# EasyEDA Pro project ProPrj_三轮车_2025-08-24.epro, schematic Schematic4
Board Name: 电源板; Create Date: 2025-01-04; Page Name: P1; Project Name: 三轮车; Schematic Name: Schematic4; Update Date: 2025-01-04; Company: 嘉立创EDA; Page Size: A4; Version: V1.0
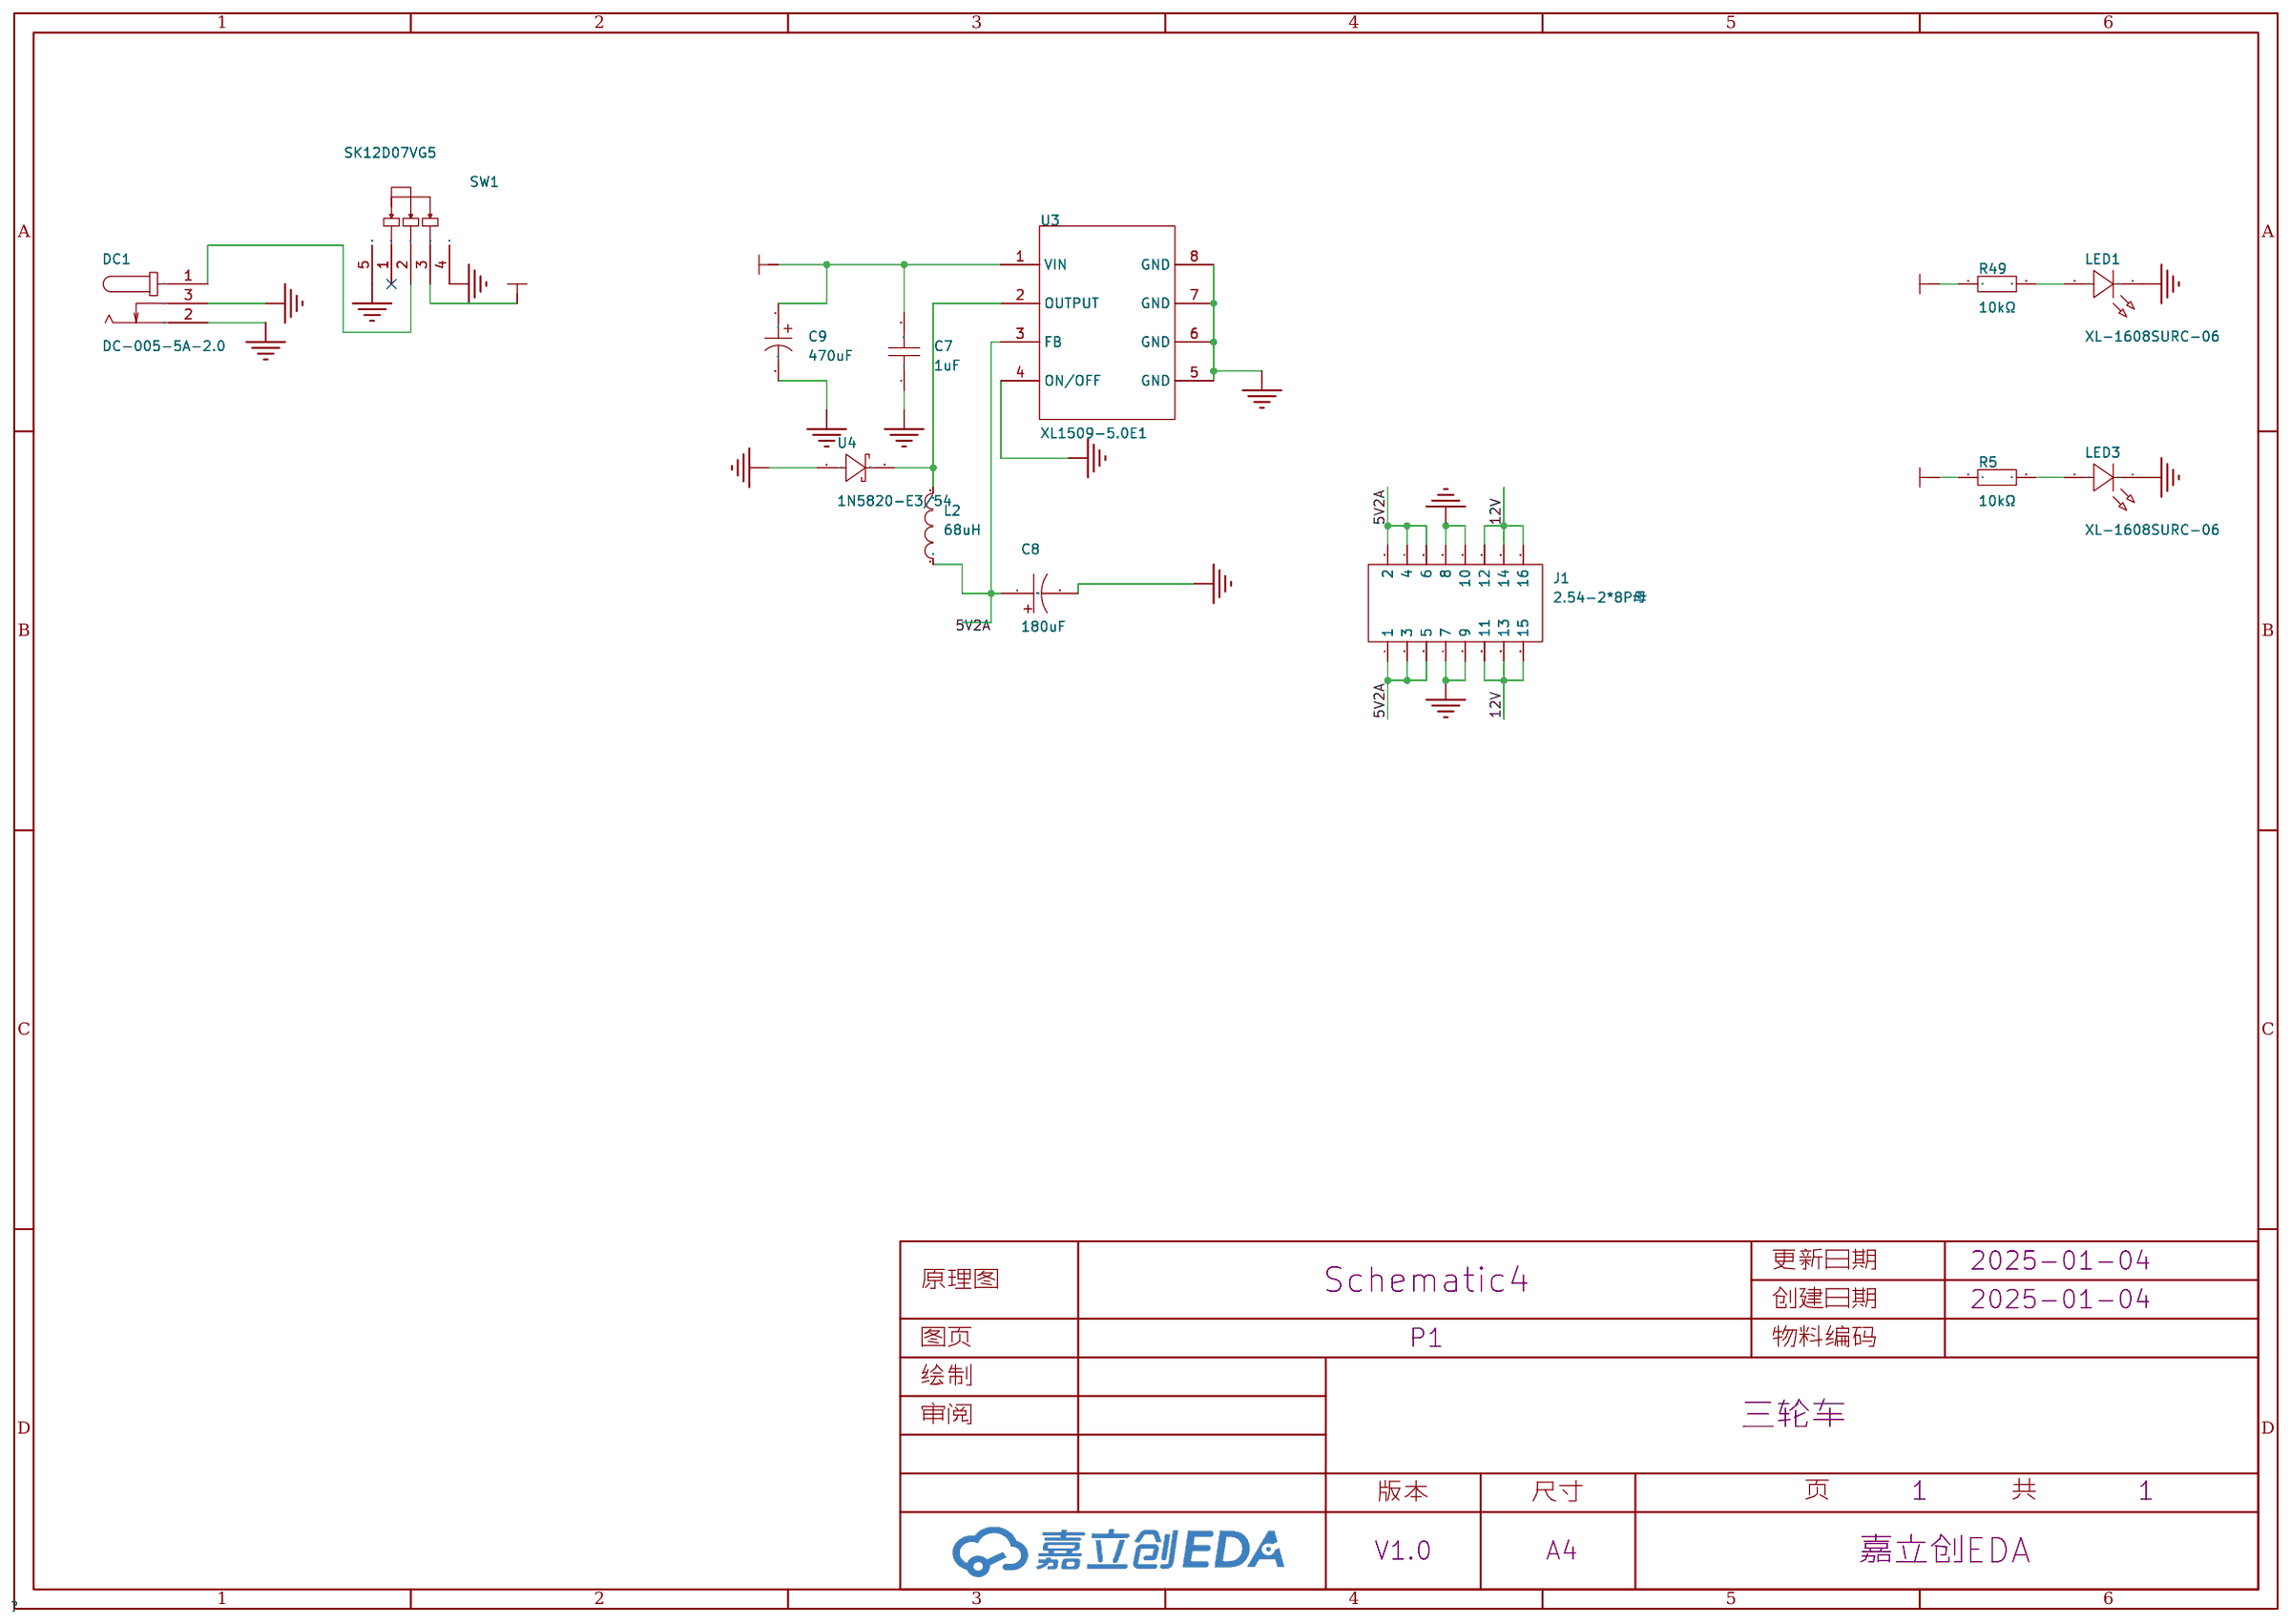
[diagram p5: schematic sheet]

## Parts
C7  1uF  [C0603]
C8  180uF  [CAP-TH_BD8.0-P3.50-D0.6-FD]
C9  470uF  [CAP-TH_BD8.0-P3.50-D0.6-FD_1]
DC1  DC-005-5A-2.0  [DC-IN-TH_DC-005-5A-2.0]
J1  2.54-2*8P母  [HDR-TH_16P-P2.54-V-F-R2-C8-S2.54]
L2  68uH  [IND-SMD_L7.1-W6.6-1]
LED1  XL-1608SURC-06  [LED0603-RD_RED]
LED3  XL-1608SURC-06  [LED0603-RD_RED]
R5  10kΩ  [R0603]
R49  10kΩ  [R0603]
SW1  SK12D07VG5  [SW-TH_SK12D07VG5]
U3  XL1509-5.0E1  [SOIC-8_L5.0-W4.0-P1.27-LS6.0-BL]
U4  1N5820-E3/54  [DO-201AD_BD5.3-L8.4-P12.50-D1.4-FD]

## Library data of the parts
C7 = CGA0603X5R105K160JT: 容值:1uF;精度:±10%;额定电压:16V;材质(温度系数):X5R;; LCSC Part Name: 1uF ±10% 16V; Supplier Part: C6119849; Manufacturer: HRE(芯声); Supplier Footprint: 0603; JLCPCB Part Class: 扩展库; Supplier: LCSC; Tolerance: ±10%; Voltage Rated: 16V; Temperature Coefficient: X5R
C8 = LKMD0901V181MF: 容值:180uF;精度:±20%;额定电压:35V;纹波电流:900mA@100kHz;等效串联电阻:210mΩ@100kHz;; LCSC Part Name: 180uF ±20% 35V; Supplier Part: C442870; Manufacturer: Ymin(永铭); Supplier Footprint: 插件,D8xL9mm; JLCPCB Part Class: 扩展库; Datasheet: https://atta.szlcsc.com/upload/public/pdf/source/20200220/C487520_443A40905984A455D375EE990FEAA9E8.pdf; Supplier: LCSC; Tolerance: ±20%; Rated Voltage: 35V; Ripple Current: 900mA@100kHz; Equivalent Series Resistance(ESR): 210mΩ@100kHz; Lead Spacing: 3.5mm; φD: 8mm; L: 9mm; Lifetime @ Temp: 10000hrs@105℃
C9 = CD2884771EM0812VFL: 容值:470uF;额定电压:25V;; LCSC Part Name: 470uF 25V; Supplier Part: C2960233; Manufacturer: HRK(鸿瑞凯电子); Supplier Footprint: 插件,D8xL12mm; JLCPCB Part Class: 扩展库; Datasheet: https://atta.szlcsc.com/upload/public/pdf/source/20240703/D49961C1CEC6E325964F7113D69E9087.pdf; Supplier: LCSC; Rated Voltage: 25V; φD: 8mm; L: 12mm; Operating Temperature: -40℃~+105℃
DC1 = DC-005-5A-2.0: 连接器类型:DC电源插座;安装方式:弯插;触点内径:2mm;触点外径:6.2mm;额定电流:5A;额定电压:24V;工作温度范围:-20℃~+70℃;; LCSC Part Name: DC电源插座 内径:2mm 外径:6.2mm; Supplier Part: C381116; Manufacturer: XKB Connection(中国星坤); Supplier Footprint: 插件; JLCPCB Part Class: 扩展库; Datasheet: https://atta.szlcsc.com/upload/public/pdf/source/20211015/707A35F7AB6E89C57AAB641950105BB7.pdf; Supplier: LCSC; Connector Type: DC电源插座; Mounting Style: 弯插; Inside Contact Diameter: 2mm; Outside Contact Diameter: 6.2mm; Current Rating (Max): 5A; Voltage Rating (Max): 24V; Operating Temperature Range: -20℃~+70℃
J1 = 2.54-2*8P母: 插孔结构:2x8P;间距:2.54mm;行距:2.54mm;安装类型:直插;排数:双排;总孔位数:16P;塑高:-;触头材质:黄铜;触头镀层:-;; LCSC Part Name: 间距:2.54mm 2x8P 直插; Supplier Part: C30734; Manufacturer: BOOMELE(博穆精密); Supplier Footprint: 插件,P=2.54mm; JLCPCB Part Class: 扩展库; Datasheet: https://atta.szlcsc.com/upload/public/pdf/source/20230817/400B44B2F3F98035DBB6B63900A9163B.pdf; Supplier: LCSC; Holes Structure: 2x8P; Pitch: 2.54mm; Row Spacing: 2.54mm; Mounting Type: 直插; Number of Rows: 双排; Number of Holes: 16P; Contact Material: 黄铜
L2 = PSPMAA0605H-680M-IGF: 电感值:68uH;精度:±20%;额定电流:2A;饱和电流(Isat):2.5A;; LCSC Part Name: 68uH ±20% 2.5A; Supplier Part: C2983094; Manufacturer: PROD(谱罗德); Supplier Footprint: SMD,6.6x7.1mm; JLCPCB Part Class: 扩展库; Datasheet: https://atta.szlcsc.com/upload/public/pdf/source/20220421/FA7B36985F5EDDBED7850D2E38F6BF27.pdf; Supplier: LCSC; Tolerance: ±20%; Rated Current: 2A; Saturation Current (Isat): 2.5A; DC Resistance (DCR): 256mΩ; Ratings: AEC-Q200
LED1 LED3 = XL-1608SURC-06: 发光颜色:红色;功率:55mW;正向电流:25mA;主波长:617nm~621nm;透镜颜色:无色透明透镜;色温:-;发光角度:120°;载带方式:正贴;工作温度:-30℃~+85℃;; Supplier Part: C965799; Manufacturer: XINGLIGHT(成兴光); Supplier Footprint: 0603; JLCPCB Part Class: 扩展库; Datasheet: https://atta.szlcsc.com/upload/public/pdf/source/20221102/D860AFDD1CDB02C5A8064103A32707E2.pdf; Supplier: LCSC; Emitted Color: 红色; Power Dissipation: 55mW; Forward Current: 25mA; Dominant Wavelength: 617nm~621nm; Peak Wavelength: 623nm; Lens Color: 无色透明透镜; Viewing Angle: 120°; Mounting Sytle: 正贴; Operating Temperature: -30℃~+85℃
R5 R49 = 0603WAF1002T5E: 电阻类型:厚膜电阻;阻值:10kΩ;精度:±1%;功率:100mW;最大工作电压:75V;温度系数:±100ppm/℃;; LCSC Part Name: 厚膜电阻 10kΩ ±1% 100mW; Supplier Part: C25804; Manufacturer: UNI-ROYAL(厚声); Supplier Footprint: 0603; JLCPCB Part Class: Basic Part; Datasheet: https://atta.szlcsc.com/upload/public/pdf/source/20200306/C422600_1E6D84923E4A46A82E41ADD87F860B5C.pdf; Supplier: LCSC; Type: 厚膜电阻; Tolerance: ±1%; Power(Watts): 100mW; Overload Voltage (Max): 75V; Temperature Coefficient: ±100ppm/℃; Operating Temperature Range: -55℃~+155℃
SW1 = SK12D07VG5: 电路结构:单刀双掷;安装方式:侧插;开关颜色:-;额定电流(DC):500mA;额定电压(DC):50V;额定电流(AC):-;额定电压(AC):-;机械寿命:5千次;; LCSC Part Name: 两档位卧式拨动开关,柄长5MM; Supplier Part: C431548; Manufacturer: SHOU HAN(首韩); Supplier Footprint: 插件; JLCPCB Part Class: 扩展库; Datasheet: https://atta.szlcsc.com/upload/public/pdf/source/20190925/C431548_D6571AEBDE139FDB1E6F8A4B1513A630.pdf; Supplier: LCSC; Circuit: 单刀双掷; Pin Style: PC引脚; Switch Length: 8.7mm; Switch Width: 4.4mm; Switch Height: 4.7mm; Mounting Style: 侧插; Current Rating (DC): 500mA; Voltage Rating (DC): 50V; Mechanical Life: 5千次; Operating Temperature: -10℃~+50℃
U3 = XL1509-5.0E1: 功能类型:降压型;输入电压:4.5V~40V;输出电流:2A;; LCSC Part Name: 2A 150KHz 40V 降压 DC-DC 转换器; Supplier Part: C61063; Manufacturer: XLSEMI(芯龙); Supplier Footprint: SOIC-8; JLCPCB Part Class: 基础库; Datasheet: https://atta.szlcsc.com/upload/public/pdf/source/20151126/1457707596805.pdf; Supplier: LCSC; Function: 降压型; Input Voltage: 4.5V~40V; Output Current: 2A; Switching Frequency: 150kHz; Operating Temperature: -40℃~+125℃@(TJ); Number of Outputs: 1; Topology: 降压式; Switch tube (built-in/external): 内置
U4 = 1N5820-E3/54: 正向压降(Vf):475mV@3A;直流反向耐压(Vr):20V;整流电流:3A;; LCSC Part Name: 电压:20V 电流:3A; Supplier Part: C5357977; Manufacturer: VISHAY(威世); Supplier Footprint: DO-201AD; JLCPCB Part Class: Extended Part; Datasheet: https://atta.szlcsc.com/upload/public/pdf/source/20231213/4CD9FBE9F25054130E4EF21C8CAD5061.pdf; Supplier: LCSC; Forward Voltage (Vf@If): 475mV@3A; Reverse Voltage (Vr): 20V; Rectified Current: 3A; Reverse Leakage Current (Ir): 2mA@20V

## Nets
5V2A: C8.1 J1.1 J1.2 J1.3 J1.4 J1.5 J1.6 L2.1 R5.1 U3.3(FB)
12V: C7.2 C9.1 J1.11 J1.12 J1.13 J1.14 J1.15 J1.16 R49.1 SW1.3 U3.1(VIN)
GND: C7.1 C8.2 C9.2 DC1.2 DC1.3 J1.7 J1.8 J1.9 J1.10 LED1.1(K) LED3.1(K) SW1.4 SW1.5 U3.4(ON/OFF) U3.5(GND) U3.6(GND) U3.7(GND) U3.8(GND) U4.1(A)
$1N970: DC1.1 SW1.2
$1N977: LED1.2(A) R49.2
$1N980: LED3.2(A) R5.2
$1N992: L2.2 U3.2(OUTPUT) U4.2(C)

Not connected (* = marked no-connect by the designer): SW1 1*
